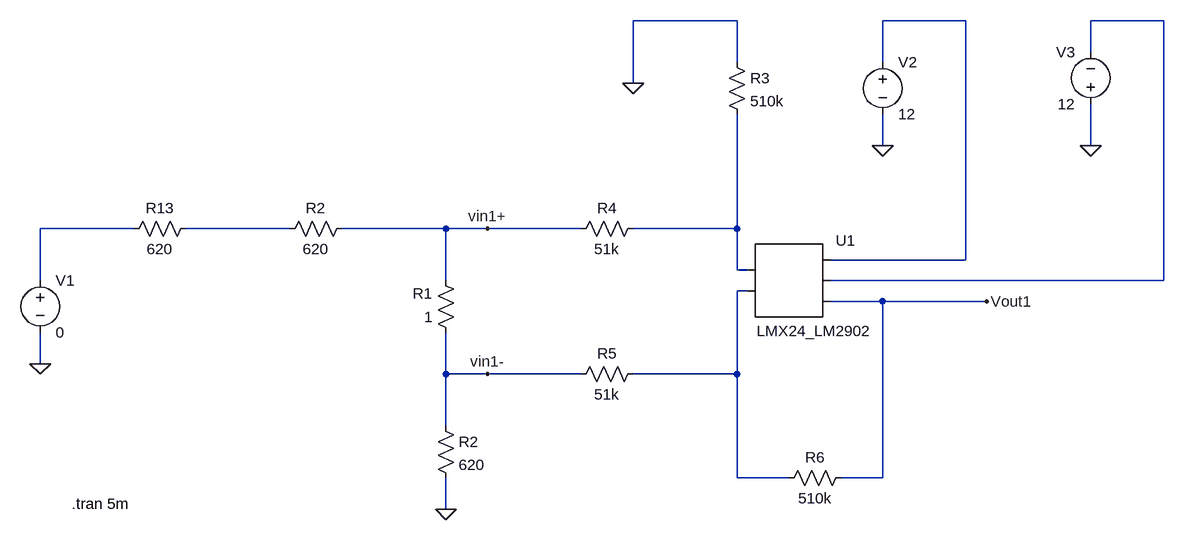
[diagram p0: schematic SimulacaoRelatorio1Parte4ComResistor.asc]
SimulacaoRelatorio1Parte4ComResistor.asc, the LTspice schematic file:
Version 4
SHEET 1 1732 680
WIRE 1072 -256 912 -256
WIRE 1424 -256 1296 -256
WIRE 1728 -256 1616 -256
WIRE 1616 -208 1616 -256
WIRE 1072 -192 1072 -256
WIRE 1296 -192 1296 -256
WIRE 912 -160 912 -256
WIRE 1296 -64 1296 -112
WIRE 1616 -64 1616 -128
WIRE 144 64 0 64
WIRE 384 64 224 64
WIRE 624 64 464 64
WIRE 688 64 624 64
WIRE 832 64 688 64
WIRE 1072 64 1072 -112
WIRE 1072 64 912 64
WIRE 1424 112 1424 -256
WIRE 1424 112 1216 112
WIRE 1072 128 1072 64
WIRE 1088 128 1072 128
WIRE 0 144 0 64
WIRE 624 144 624 64
WIRE 1728 144 1728 -256
WIRE 1728 144 1216 144
WIRE 1088 160 1072 160
WIRE 1296 176 1216 176
WIRE 1456 176 1296 176
WIRE 0 272 0 224
WIRE 624 288 624 224
WIRE 688 288 624 288
WIRE 832 288 688 288
WIRE 1072 288 1072 160
WIRE 1072 288 912 288
WIRE 624 368 624 288
WIRE 1072 448 1072 288
WIRE 1152 448 1072 448
WIRE 1296 448 1296 176
WIRE 1296 448 1232 448
WIRE 624 496 624 448
FLAG 0 272 0
FLAG 912 -160 0
FLAG 1296 -64 0
FLAG 1616 -64 0
FLAG 1456 176 Vout1
FLAG 624 496 0
FLAG 688 64 vin1+
FLAG 688 288 vin1-
SYMBOL voltage 0 128 R0
SYMATTR InstName V1
SYMATTR Value 0
SYMBOL res 640 240 R180
WINDOW 0 36 76 Left 2
WINDOW 3 36 40 Left 2
SYMATTR InstName R1
SYMATTR Value 1
SYMBOL res 816 304 R270
WINDOW 0 32 56 VTop 2
WINDOW 3 0 56 VBottom 2
SYMATTR InstName R5
SYMATTR Value 51k
SYMBOL res 928 48 R90
WINDOW 0 0 56 VBottom 2
WINDOW 3 32 56 VTop 2
SYMATTR InstName R4
SYMATTR Value 51k
SYMBOL AutoGenerated\\LMX24_LM2902 1152 144 R0
WINDOW 3 39 62 Top 2
SYMATTR InstName U1
SYMBOL res 1056 -208 R0
SYMATTR InstName R3
SYMATTR Value 510k
SYMBOL voltage 1296 -208 R0
SYMATTR InstName V2
SYMATTR Value 12
SYMBOL voltage 1616 -112 R180
WINDOW 0 24 96 Left 2
WINDOW 3 24 16 Left 2
WINDOW 123 0 0 Left 0
WINDOW 39 0 0 Left 0
SYMATTR InstName V3
SYMATTR Value 12
SYMBOL res 240 48 R90
WINDOW 0 0 56 VBottom 2
WINDOW 3 32 56 VTop 2
SYMATTR InstName R13
SYMATTR Value 620
SYMBOL res 608 352 R0
SYMATTR InstName R2
SYMATTR Value 620
SYMBOL res 1248 432 R90
WINDOW 0 0 56 VBottom 2
WINDOW 3 32 56 VTop 2
SYMATTR InstName R6
SYMATTR Value 510k
SYMBOL res 480 48 R90
WINDOW 0 0 56 VBottom 2
WINDOW 3 32 56 VTop 2
SYMATTR InstName R2
SYMATTR Value 620
TEXT 48 488 Left 2 !.tran 5m

The netlist it stands for:
* SimulacaoRelatorio1Parte4ComResistor.asc
V1 N003 0 0
R1 vin1- vin1+ 1
R5 vin1- N006 51k
R4 N005 vin1+ 51k
* U1: LMX24_LM2902 (symbol AutoGenerated\LMX24_LM2902 not available, pins judged from their places): pin1=N005 pin2=N006 pin3=N001 pin4=N002 pin5=Vout1
R3 0 N005 510k
V2 N001 0 12
V3 0 N002 12
R13 N004 N003 620
R2 vin1- 0 620
R6 Vout1 N006 510k
R2 vin1+ N004 620
.tran 5m
.backanno
.end